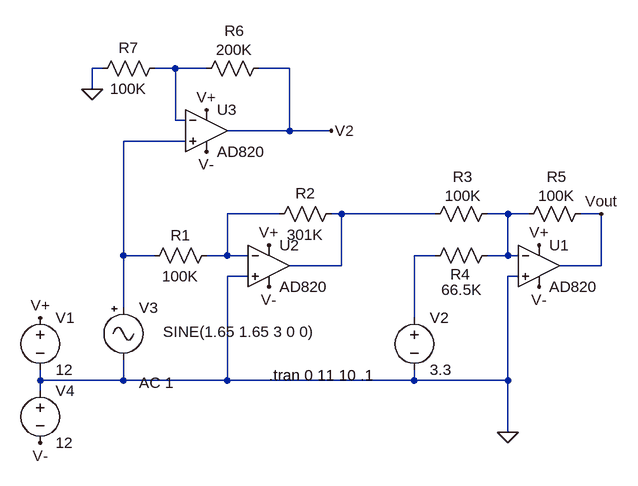
[diagram p0: schematic spank_output_analog.asc]
spank_output_analog.asc, the LTspice schematic file:
Version 4
SHEET 1 880 792
WIRE -48 144 -64 144
WIRE 64 144 32 144
WIRE 112 144 64 144
WIRE 240 144 192 144
WIRE -64 176 -64 144
WIRE 64 224 64 144
WIRE 80 224 64 224
WIRE 240 240 240 144
WIRE 240 240 144 240
WIRE 304 240 240 240
WIRE 80 256 -16 256
WIRE 224 368 144 368
WIRE 320 368 304 368
WIRE 464 368 320 368
WIRE 576 368 544 368
WIRE 608 368 576 368
WIRE 720 368 688 368
WIRE -16 432 -16 256
WIRE 32 432 -16 432
WIRE 144 432 144 368
WIRE 144 432 112 432
WIRE 176 432 144 432
WIRE 464 432 432 432
WIRE 576 432 576 368
WIRE 576 432 544 432
WIRE 592 432 576 432
WIRE 320 448 320 368
WIRE 320 448 240 448
WIRE 720 448 720 368
WIRE 720 448 656 448
WIRE 176 464 144 464
WIRE 592 464 576 464
WIRE -16 512 -16 432
WIRE 432 528 432 432
WIRE -144 624 -144 608
WIRE -16 624 -16 592
WIRE -16 624 -144 624
WIRE 144 624 144 464
WIRE 144 624 -16 624
WIRE 432 624 432 608
WIRE 432 624 144 624
WIRE 576 624 576 464
WIRE 576 624 432 624
WIRE -144 640 -144 624
WIRE 576 704 576 624
FLAG 576 704 0
FLAG -144 528 V+
FLAG 208 416 V+
FLAG -144 720 V-
FLAG 208 480 V-
FLAG 624 480 V-
FLAG 624 416 V+
FLAG 720 368 Vout
FLAG 112 208 V+
FLAG 112 272 V-
FLAG -64 176 0
FLAG 304 240 V2
SYMBOL res 320 352 R90
WINDOW 0 0 56 VBottom 2
WINDOW 3 32 56 VTop 2
SYMATTR InstName R2
SYMATTR Value 301K
SYMBOL Misc\\signal -16 496 R0
WINDOW 123 24 132 Left 2
WINDOW 39 0 0 Left 0
WINDOW 3 61 53 Left 2
SYMATTR Value2 AC 1
SYMATTR Value SINE(1.65 1.65 3 0 0)
SYMATTR InstName V3
SYMBOL voltage 432 512 R0
WINDOW 123 0 0 Left 0
WINDOW 39 0 0 Left 0
SYMATTR InstName V2
SYMATTR Value 3.3
SYMBOL res 560 416 R90
WINDOW 0 60 57 VBottom 2
WINDOW 3 53 55 VTop 2
SYMATTR InstName R4
SYMATTR Value 66.5K
SYMBOL Opamps\\AD820 208 384 R0
SYMATTR InstName U2
SYMBOL voltage -144 512 R0
WINDOW 123 0 0 Left 0
WINDOW 39 0 0 Left 0
SYMATTR InstName V1
SYMATTR Value 12
SYMBOL voltage -144 624 R0
WINDOW 123 0 0 Left 0
WINDOW 39 0 0 Left 0
SYMATTR InstName V4
SYMATTR Value 12
SYMBOL res 128 416 R90
WINDOW 0 0 56 VBottom 2
WINDOW 3 32 56 VTop 2
SYMATTR InstName R1
SYMATTR Value 100K
SYMBOL Opamps\\AD820 624 384 R0
SYMATTR InstName U1
SYMBOL res 560 352 R90
WINDOW 0 -26 53 VBottom 2
WINDOW 3 -28 53 VTop 2
SYMATTR InstName R3
SYMATTR Value 100K
SYMBOL res 704 352 R90
WINDOW 0 -26 53 VBottom 2
WINDOW 3 -28 53 VTop 2
SYMATTR InstName R5
SYMATTR Value 100K
SYMBOL Opamps\\AD820 112 176 R0
SYMATTR InstName U3
SYMBOL res 208 128 R90
WINDOW 0 -26 53 VBottom 2
WINDOW 3 -28 53 VTop 2
SYMATTR InstName R6
SYMATTR Value 200K
SYMBOL res 48 128 R90
WINDOW 0 0 56 VBottom 2
WINDOW 3 32 56 VTop 2
SYMATTR InstName R7
SYMATTR Value 100K
TEXT 208 616 Left 2 !.tran 0 11 10 .1

The netlist it stands for:
* spank_output_analog.asc
R2 N004 N003 301K
V3 N002 0 SINE(1.65 1.65 3 0 0) AC 1
V2 N006 0 3.3
R4 N005 N006 66.5K
XU2 0 N003 V+ V- N004 AD820  ; pins In+ In- V+ V- OUT
V1 V+ 0 12
V4 0 V- 12
R1 N003 N002 100K
XU1 0 N005 V+ V- Vout AD820  ; pins In+ In- V+ V- OUT
R3 N005 N004 100K
R5 Vout N005 100K
XU3 N002 N001 V+ V- V2 AD820  ; pins In+ In- V+ V- OUT
R6 V2 N001 200K
R7 N001 0 100K
.tran 0 11 10 .1
.backanno
.end